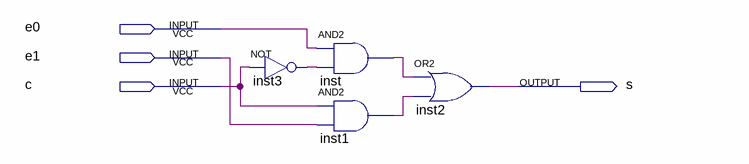
[diagram p0: schematic sheet]
// Quartus schematic mux2x1.bdf as structural Verilog: 4 symbols, 4 pins
module mux2x1 (
  input  e0,
  input  e1,
  input  c,
  output s
);

  wire inst1_out, inst3_out, inst_out;

  not inst3 (inst3_out, c);
  and inst (inst_out, e0, inst3_out);
  and inst1 (inst1_out, c, e1);
  or inst2 (s, inst_out, inst1_out);
endmodule
